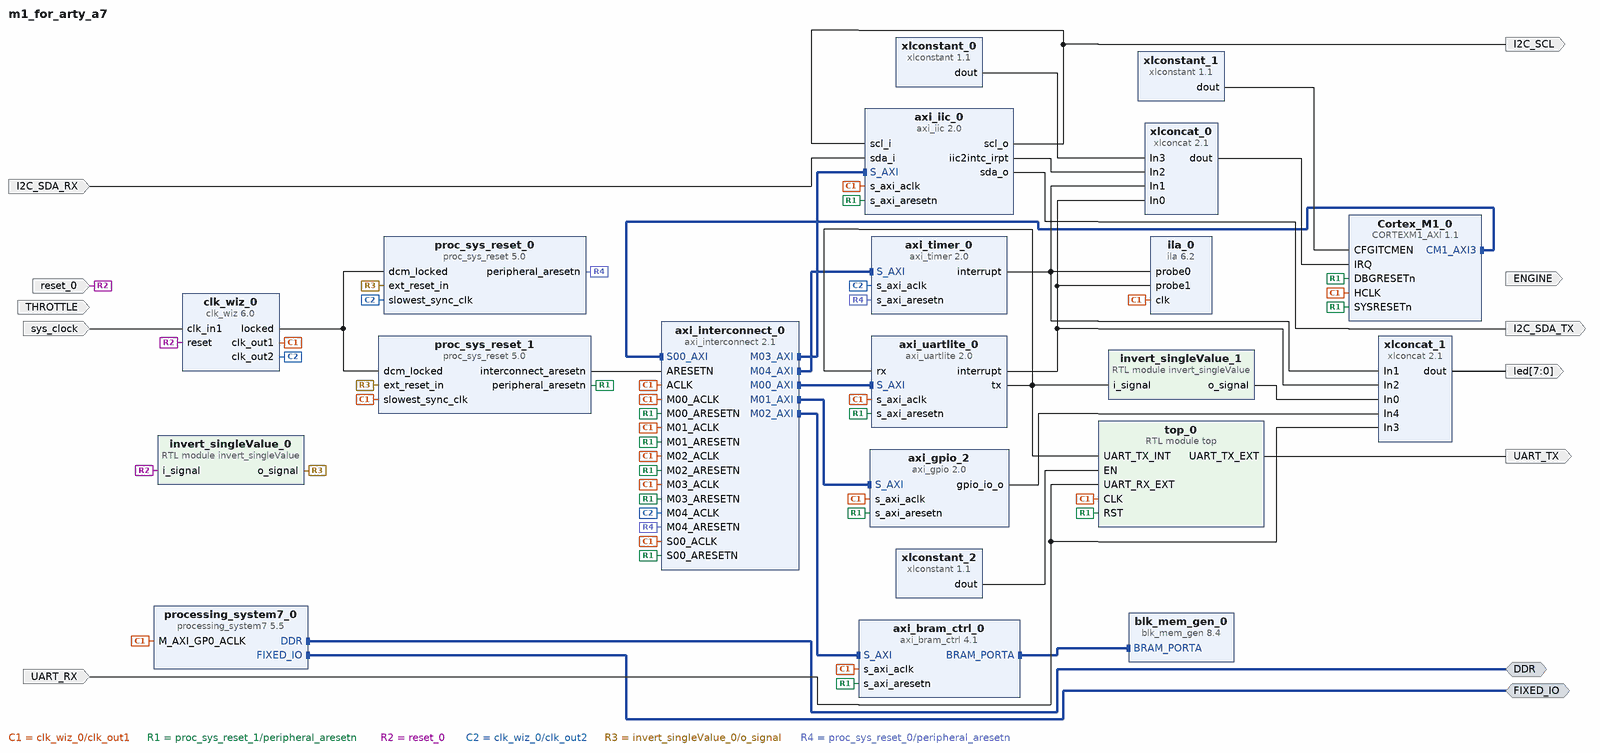
[diagram p0: block diagram of the top level]
# Vivado block design m1_for_arty_a7, xc7z020clg484-1, Vivado 2018.3
create_bd_design m1_for_arty_a7

create_bd_intf_port -mode Master -vlnv xilinx.com:interface:ddrx_rtl:1.0 DDR
create_bd_intf_port -mode Master -vlnv xilinx.com:display_processing_system7:fixedio_rtl:1.0 FIXED_IO
create_bd_port -dir O ENGINE
create_bd_port -dir I THROTTLE
create_bd_port -dir O -from 7 -to 0 led
create_bd_port -dir I -type rst reset_0
set_property -dict {CONFIG.POLARITY ACTIVE_HIGH} [get_bd_ports reset_0]
create_bd_port -dir I UART_RX
create_bd_port -dir I -type clk sys_clock
set_property -dict {CONFIG.FREQ_HZ 100000000 CONFIG.PHASE 0.000} [get_bd_ports sys_clock]
create_bd_port -dir O UART_TX
create_bd_port -dir O I2C_SCL
create_bd_port -dir O I2C_SDA_TX
create_bd_port -dir I I2C_SDA_RX

create_bd_cell -type ip -vlnv arm.com:CortexM:CORTEXM1_AXI:1.1 Cortex_M1_0
set_property -dict [list \
  CONFIG.DEBUG_SEL 1 \
  CONFIG.DTCM_SIZE {"0111"} \
  CONFIG.ITCM_INIT_FILE bram_a7.hex \
  CONFIG.ITCM_INIT_RAM true \
  CONFIG.ITCM_SIZE {"0110"} \
  CONFIG.NUM_IRQ 32 \
  CONFIG.SMALL_DEBUG true \
] [get_bd_cells Cortex_M1_0]
create_bd_cell -type ip -vlnv xilinx.com:ip:xlconcat:2.1 xlconcat_1
set_property -dict [list \
  CONFIG.IN0_WIDTH 1 \
  CONFIG.IN1_WIDTH 1 \
  CONFIG.IN2_WIDTH 1 \
  CONFIG.IN3_WIDTH 1 \
  CONFIG.IN4_WIDTH 4 \
  CONFIG.NUM_PORTS 5 \
] [get_bd_cells xlconcat_1]
create_bd_cell -type ip -vlnv xilinx.com:ip:processing_system7:5.5 processing_system7_0
set_property -dict [list \
  CONFIG.PCW_APU_PERIPHERAL_FREQMHZ 666.666667 \
  CONFIG.PCW_ENET0_ENET0_IO {MIO 16 .. 27} \
  CONFIG.PCW_ENET0_GRP_MDIO_ENABLE 1 \
  CONFIG.PCW_ENET0_GRP_MDIO_IO {MIO 52 .. 53} \
  CONFIG.PCW_ENET0_PERIPHERAL_ENABLE 1 \
  CONFIG.PCW_ENET0_RESET_ENABLE 0 \
  CONFIG.PCW_ENET_RESET_ENABLE 1 \
  CONFIG.PCW_ENET_RESET_SELECT {Share reset pin} \
  CONFIG.PCW_FPGA0_PERIPHERAL_FREQMHZ 100.000000 \
  CONFIG.PCW_FPGA1_PERIPHERAL_FREQMHZ 150.000000 \
  CONFIG.PCW_GPIO_MIO_GPIO_ENABLE 1 \
  CONFIG.PCW_GPIO_MIO_GPIO_IO MIO \
  CONFIG.PCW_I2C_RESET_ENABLE 1 \
  CONFIG.PCW_PRESET_BANK1_VOLTAGE {LVCMOS 1.8V} \
  CONFIG.PCW_QSPI_GRP_SINGLE_SS_ENABLE 1 \
  CONFIG.PCW_QSPI_GRP_SINGLE_SS_IO {MIO 1 .. 6} \
  CONFIG.PCW_QSPI_PERIPHERAL_ENABLE 1 \
  CONFIG.PCW_QSPI_QSPI_IO {MIO 1 .. 6} \
  CONFIG.PCW_SD0_GRP_CD_ENABLE 1 \
  CONFIG.PCW_SD0_GRP_CD_IO {MIO 47} \
  CONFIG.PCW_SD0_GRP_WP_ENABLE 1 \
  CONFIG.PCW_SD0_GRP_WP_IO {MIO 46} \
  CONFIG.PCW_SD0_PERIPHERAL_ENABLE 1 \
  CONFIG.PCW_SD0_SD0_IO {MIO 40 .. 45} \
  CONFIG.PCW_SDIO_PERIPHERAL_FREQMHZ 50 \
  CONFIG.PCW_SINGLE_QSPI_DATA_MODE x4 \
  CONFIG.PCW_TTC0_PERIPHERAL_ENABLE 1 \
  CONFIG.PCW_TTC0_TTC0_IO EMIO \
  CONFIG.PCW_UART1_PERIPHERAL_ENABLE 1 \
  CONFIG.PCW_UART1_UART1_IO {MIO 48 .. 49} \
  CONFIG.PCW_UART_PERIPHERAL_FREQMHZ 50 \
  CONFIG.PCW_UIPARAM_DDR_FREQ_MHZ 533.333313 \
  CONFIG.PCW_UIPARAM_DDR_PARTNO {MT41J128M16 HA-15E} \
  CONFIG.PCW_USB0_PERIPHERAL_ENABLE 1 \
  CONFIG.PCW_USB0_RESET_ENABLE 0 \
  CONFIG.PCW_USB0_USB0_IO {MIO 28 .. 39} \
  CONFIG.PCW_USB_RESET_ENABLE 1 \
  CONFIG.PCW_USB_RESET_SELECT {Share reset pin} \
  CONFIG.preset ZedBoard \
] [get_bd_cells processing_system7_0]
# 223 more settings of processing_system7_0 are not shown: defaults, MIO pin electricals, DDR timing, and values the tool derives
create_bd_cell -type ip -vlnv xilinx.com:ip:xlconcat:2.1 xlconcat_0
set_property -dict [list \
  CONFIG.IN0_WIDTH 1 \
  CONFIG.IN1_WIDTH 1 \
  CONFIG.IN2_WIDTH 1 \
  CONFIG.IN3_WIDTH 29 \
  CONFIG.IN7_WIDTH 24 \
  CONFIG.NUM_PORTS 4 \
] [get_bd_cells xlconcat_0]
create_bd_cell -type module -reference top top_0
create_bd_cell -type ip -vlnv xilinx.com:ip:axi_bram_ctrl:4.1 axi_bram_ctrl_0
set_property -dict {CONFIG.C_SELECT_XPM 0 CONFIG.PROTOCOL AXI4LITE CONFIG.SINGLE_PORT_BRAM 1} [get_bd_cells axi_bram_ctrl_0]
create_bd_cell -type ip -vlnv xilinx.com:ip:axi_gpio:2.0 axi_gpio_2
set_property -dict [list \
  CONFIG.C_ALL_OUTPUTS 1 \
  CONFIG.C_GPIO_WIDTH 4 \
  CONFIG.GPIO_BOARD_INTERFACE Custom \
  CONFIG.USE_BOARD_FLOW true \
] [get_bd_cells axi_gpio_2]
create_bd_cell -type ip -vlnv xilinx.com:ip:axi_iic:2.0 axi_iic_0
create_bd_cell -type ip -vlnv xilinx.com:ip:axi_interconnect:2.1 axi_interconnect_0
set_property -dict [list \
  CONFIG.ENABLE_ADVANCED_OPTIONS 1 \
  CONFIG.ENABLE_PROTOCOL_CHECKERS 0 \
  CONFIG.M00_HAS_DATA_FIFO 0 \
  CONFIG.M00_HAS_REGSLICE 0 \
  CONFIG.M00_SECURE 0 \
  CONFIG.M01_HAS_DATA_FIFO 0 \
  CONFIG.M01_HAS_REGSLICE 0 \
  CONFIG.M01_SECURE 0 \
  CONFIG.M02_HAS_REGSLICE 0 \
  CONFIG.M02_SECURE 0 \
  CONFIG.M03_HAS_REGSLICE 0 \
  CONFIG.M04_HAS_REGSLICE 0 \
  CONFIG.M05_HAS_REGSLICE 0 \
  CONFIG.NUM_MI 5 \
  CONFIG.NUM_SI 1 \
  CONFIG.S00_HAS_DATA_FIFO 0 \
  CONFIG.S00_HAS_REGSLICE 3 \
  CONFIG.S01_HAS_DATA_FIFO 1 \
  CONFIG.S01_HAS_REGSLICE 3 \
  CONFIG.STRATEGY 0 \
  CONFIG.SYNCHRONIZATION_STAGES 3 \
  CONFIG.XBAR_DATA_WIDTH 32 \
] [get_bd_cells axi_interconnect_0]
create_bd_cell -type ip -vlnv xilinx.com:ip:axi_timer:2.0 axi_timer_0
set_property -dict {CONFIG.enable_timer2 0} [get_bd_cells axi_timer_0]
create_bd_cell -type ip -vlnv xilinx.com:ip:axi_uartlite:2.0 axi_uartlite_0
set_property -dict [list \
  CONFIG.C_BAUDRATE 115200 \
  CONFIG.C_S_AXI_ACLK_FREQ_HZ 100000000 \
  CONFIG.UARTLITE_BOARD_INTERFACE Custom \
  CONFIG.USE_BOARD_FLOW true \
] [get_bd_cells axi_uartlite_0]
create_bd_cell -type ip -vlnv xilinx.com:ip:blk_mem_gen:8.4 blk_mem_gen_0
set_property -dict {CONFIG.EN_SAFETY_CKT false} [get_bd_cells blk_mem_gen_0]
create_bd_cell -type ip -vlnv xilinx.com:ip:clk_wiz:6.0 clk_wiz_0
set_property -dict [list \
  CONFIG.CLKOUT1_JITTER 130.958 \
  CONFIG.CLKOUT1_REQUESTED_OUT_FREQ 100 \
  CONFIG.CLKOUT2_JITTER 218.754 \
  CONFIG.CLKOUT2_PHASE_ERROR 98.575 \
  CONFIG.CLKOUT2_REQUESTED_OUT_FREQ 8.000 \
  CONFIG.CLKOUT2_USED true \
  CONFIG.CLK_IN1_BOARD_INTERFACE sys_clock \
  CONFIG.MMCM_CLKOUT0_DIVIDE_F 10.000 \
  CONFIG.MMCM_CLKOUT1_DIVIDE 125 \
  CONFIG.MMCM_DIVCLK_DIVIDE 1 \
  CONFIG.NUM_OUT_CLKS 2 \
  CONFIG.USE_RESET true \
] [get_bd_cells clk_wiz_0]
create_bd_cell -type ip -vlnv xilinx.com:ip:ila:6.2 ila_0
set_property -dict [list \
  CONFIG.ALL_PROBE_SAME_MU_CNT 2 \
  CONFIG.C_ADV_TRIGGER true \
  CONFIG.C_DATA_DEPTH 131072 \
  CONFIG.C_ENABLE_ILA_AXI_MON false \
  CONFIG.C_EN_STRG_QUAL 1 \
  CONFIG.C_MONITOR_TYPE Native \
  CONFIG.C_NUM_OF_PROBES 2 \
  CONFIG.C_PROBE0_MU_CNT 2 \
  CONFIG.C_PROBE10_MU_CNT 2 \
  CONFIG.C_PROBE11_MU_CNT 2 \
  CONFIG.C_PROBE12_MU_CNT 2 \
  CONFIG.C_PROBE13_MU_CNT 2 \
  CONFIG.C_PROBE14_MU_CNT 2 \
  CONFIG.C_PROBE15_MU_CNT 2 \
  CONFIG.C_PROBE16_MU_CNT 2 \
  CONFIG.C_PROBE17_MU_CNT 2 \
  CONFIG.C_PROBE18_MU_CNT 2 \
  CONFIG.C_PROBE19_MU_CNT 2 \
  CONFIG.C_PROBE1_MU_CNT 2 \
  CONFIG.C_PROBE20_MU_CNT 2 \
  CONFIG.C_PROBE21_MU_CNT 2 \
  CONFIG.C_PROBE22_MU_CNT 2 \
  CONFIG.C_PROBE23_MU_CNT 2 \
  CONFIG.C_PROBE24_MU_CNT 2 \
  CONFIG.C_PROBE25_MU_CNT 2 \
  CONFIG.C_PROBE26_MU_CNT 2 \
  CONFIG.C_PROBE27_MU_CNT 2 \
  CONFIG.C_PROBE28_MU_CNT 2 \
  CONFIG.C_PROBE29_MU_CNT 2 \
  CONFIG.C_PROBE2_MU_CNT 2 \
  CONFIG.C_PROBE30_MU_CNT 2 \
  CONFIG.C_PROBE31_MU_CNT 2 \
  CONFIG.C_PROBE32_MU_CNT 2 \
  CONFIG.C_PROBE33_MU_CNT 2 \
  CONFIG.C_PROBE34_MU_CNT 2 \
  CONFIG.C_PROBE35_MU_CNT 2 \
  CONFIG.C_PROBE36_MU_CNT 2 \
  CONFIG.C_PROBE37_MU_CNT 2 \
  CONFIG.C_PROBE38_MU_CNT 2 \
  CONFIG.C_PROBE39_MU_CNT 2 \
  CONFIG.C_PROBE3_MU_CNT 2 \
  CONFIG.C_PROBE40_MU_CNT 2 \
  CONFIG.C_PROBE41_MU_CNT 2 \
  CONFIG.C_PROBE42_MU_CNT 2 \
  CONFIG.C_PROBE43_MU_CNT 2 \
  CONFIG.C_PROBE4_MU_CNT 2 \
  CONFIG.C_PROBE5_MU_CNT 2 \
  CONFIG.C_PROBE6_MU_CNT 2 \
  CONFIG.C_PROBE7_MU_CNT 2 \
  CONFIG.C_PROBE8_MU_CNT 2 \
  CONFIG.C_PROBE9_MU_CNT 2 \
] [get_bd_cells ila_0]
create_bd_cell -type module -reference invert_singleValue invert_singleValue_0
create_bd_cell -type ip -vlnv xilinx.com:ip:proc_sys_reset:5.0 proc_sys_reset_0
create_bd_cell -type ip -vlnv xilinx.com:ip:proc_sys_reset:5.0 proc_sys_reset_1
create_bd_cell -type ip -vlnv xilinx.com:ip:xlconstant:1.1 xlconstant_0
set_property -dict {CONFIG.CONST_VAL 0 CONFIG.CONST_WIDTH 29} [get_bd_cells xlconstant_0]
create_bd_cell -type ip -vlnv xilinx.com:ip:xlconstant:1.1 xlconstant_2
set_property -dict {CONFIG.CONST_VAL 1 CONFIG.CONST_WIDTH 1} [get_bd_cells xlconstant_2]
create_bd_cell -type ip -vlnv xilinx.com:ip:xlconstant:1.1 xlconstant_1
set_property -dict {CONFIG.CONST_WIDTH 2} [get_bd_cells xlconstant_1]
create_bd_cell -type module -reference invert_singleValue invert_singleValue_1

# ---- connections ----

connect_bd_intf_net [get_bd_intf_pins axi_interconnect_0/M03_AXI] [get_bd_intf_pins axi_iic_0/S_AXI]
connect_bd_intf_net [get_bd_intf_pins axi_timer_0/S_AXI] [get_bd_intf_pins axi_interconnect_0/M04_AXI]
connect_bd_intf_net [get_bd_intf_pins Cortex_M1_0/CM1_AXI3] [get_bd_intf_pins axi_interconnect_0/S00_AXI]
connect_bd_intf_net [get_bd_intf_pins axi_bram_ctrl_0/BRAM_PORTA] [get_bd_intf_pins blk_mem_gen_0/BRAM_PORTA]
connect_bd_intf_net [get_bd_intf_pins axi_interconnect_0/M01_AXI] [get_bd_intf_pins axi_gpio_2/S_AXI]
connect_bd_intf_net [get_bd_intf_pins axi_interconnect_0/M02_AXI] [get_bd_intf_pins axi_bram_ctrl_0/S_AXI]
connect_bd_intf_net [get_bd_intf_ports DDR] [get_bd_intf_pins processing_system7_0/DDR]
connect_bd_intf_net [get_bd_intf_ports FIXED_IO] [get_bd_intf_pins processing_system7_0/FIXED_IO]
connect_bd_intf_net [get_bd_intf_pins axi_uartlite_0/S_AXI] [get_bd_intf_pins axi_interconnect_0/M00_AXI]
connect_bd_net [get_bd_pins clk_wiz_0/clk_out1] \
  [get_bd_pins Cortex_M1_0/HCLK] [get_bd_pins processing_system7_0/M_AXI_GP0_ACLK] [get_bd_pins top_0/CLK] \
  [get_bd_pins axi_bram_ctrl_0/s_axi_aclk] [get_bd_pins axi_gpio_2/s_axi_aclk] [get_bd_pins axi_iic_0/s_axi_aclk] \
  [get_bd_pins axi_interconnect_0/ACLK] [get_bd_pins axi_interconnect_0/S00_ACLK] [get_bd_pins axi_interconnect_0/M00_ACLK] \
  [get_bd_pins axi_interconnect_0/M01_ACLK] [get_bd_pins axi_interconnect_0/M02_ACLK] \
  [get_bd_pins axi_interconnect_0/M03_ACLK] [get_bd_pins axi_uartlite_0/s_axi_aclk] [get_bd_pins ila_0/clk] \
  [get_bd_pins proc_sys_reset_1/slowest_sync_clk]
connect_bd_net -net reset_0_1 [get_bd_pins proc_sys_reset_1/peripheral_aresetn] \
  [get_bd_pins Cortex_M1_0/SYSRESETn] [get_bd_pins Cortex_M1_0/DBGRESETn] [get_bd_pins top_0/RST] \
  [get_bd_pins axi_bram_ctrl_0/s_axi_aresetn] [get_bd_pins axi_gpio_2/s_axi_aresetn] [get_bd_pins axi_iic_0/s_axi_aresetn] \
  [get_bd_pins axi_interconnect_0/S00_ARESETN] [get_bd_pins axi_interconnect_0/M00_ARESETN] \
  [get_bd_pins axi_interconnect_0/M01_ARESETN] [get_bd_pins axi_interconnect_0/M02_ARESETN] \
  [get_bd_pins axi_interconnect_0/M03_ARESETN] [get_bd_pins axi_uartlite_0/s_axi_aresetn]
connect_bd_net [get_bd_pins xlconstant_1/dout] [get_bd_pins Cortex_M1_0/CFGITCMEN]
connect_bd_net [get_bd_pins xlconcat_1/dout] [get_bd_ports led]
connect_bd_net -net reset_0_2 [get_bd_ports reset_0] [get_bd_pins clk_wiz_0/reset] [get_bd_pins invert_singleValue_0/i_signal]
connect_bd_net [get_bd_pins xlconcat_0/dout] [get_bd_pins Cortex_M1_0/IRQ]
connect_bd_net -net axi_uartlite_0_interrupt [get_bd_pins axi_uartlite_0/interrupt] \
  [get_bd_pins xlconcat_0/In0] [get_bd_pins xlconcat_1/In2] [get_bd_pins ila_0/probe1]
connect_bd_net [get_bd_pins xlconstant_2/dout] [get_bd_pins top_0/EN]
connect_bd_net [get_bd_pins axi_gpio_2/gpio_io_o] [get_bd_pins xlconcat_1/In4]
connect_bd_net [get_bd_pins axi_uartlite_0/tx] \
  [get_bd_pins top_0/UART_TX_INT] [get_bd_pins axi_uartlite_0/rx] [get_bd_pins invert_singleValue_1/i_signal]
connect_bd_net [get_bd_pins invert_singleValue_1/o_signal] [get_bd_pins xlconcat_1/In0]
connect_bd_net -net axi_timer_0_interrupt [get_bd_pins axi_timer_0/interrupt] \
  [get_bd_pins xlconcat_0/In1] [get_bd_pins xlconcat_1/In1] [get_bd_pins ila_0/probe0]
connect_bd_net [get_bd_ports UART_RX] [get_bd_pins top_0/UART_RX_EXT] [get_bd_pins xlconcat_1/In3]
connect_bd_net [get_bd_pins xlconstant_0/dout] [get_bd_pins xlconcat_0/In3]
connect_bd_net [get_bd_pins axi_iic_0/iic2intc_irpt] [get_bd_pins xlconcat_0/In2]
connect_bd_net -net M04_ACLK_1 [get_bd_pins clk_wiz_0/clk_out2] \
  [get_bd_pins axi_interconnect_0/M04_ACLK] [get_bd_pins axi_timer_0/s_axi_aclk] \
  [get_bd_pins proc_sys_reset_0/slowest_sync_clk]
connect_bd_net [get_bd_ports sys_clock] [get_bd_pins clk_wiz_0/clk_in1]
connect_bd_net [get_bd_pins invert_singleValue_0/o_signal] [get_bd_pins proc_sys_reset_0/ext_reset_in] [get_bd_pins proc_sys_reset_1/ext_reset_in]
connect_bd_net [get_bd_pins clk_wiz_0/locked] [get_bd_pins proc_sys_reset_0/dcm_locked] [get_bd_pins proc_sys_reset_1/dcm_locked]
connect_bd_net [get_bd_pins proc_sys_reset_1/interconnect_aresetn] [get_bd_pins axi_interconnect_0/ARESETN]
connect_bd_net -net M04_ARESETN_1 [get_bd_pins proc_sys_reset_0/peripheral_aresetn] \
  [get_bd_pins axi_interconnect_0/M04_ARESETN] [get_bd_pins axi_timer_0/s_axi_aresetn]
connect_bd_net [get_bd_pins top_0/UART_TX_EXT] [get_bd_ports UART_TX]
connect_bd_net [get_bd_pins axi_iic_0/scl_o] [get_bd_ports I2C_SCL] [get_bd_pins axi_iic_0/scl_i]
connect_bd_net [get_bd_pins axi_iic_0/sda_o] [get_bd_ports I2C_SDA_TX]
connect_bd_net [get_bd_ports I2C_SDA_RX] [get_bd_pins axi_iic_0/sda_i]
set_property HDL_ATTRIBUTE.DEBUG true [get_bd_nets axi_uartlite_0_interrupt]
set_property HDL_ATTRIBUTE.MARK_DEBUG true [get_bd_nets axi_uartlite_0_interrupt]
set_property HDL_ATTRIBUTE.DEBUG true [get_bd_nets axi_timer_0_interrupt]
set_property HDL_ATTRIBUTE.MARK_DEBUG true [get_bd_nets axi_timer_0_interrupt]

# ---- address map ----
assign_bd_address -offset 0x40000000 -range 64K -target_address_space [get_bd_addr_spaces Cortex_M1_0/CM1_AXI3] [get_bd_addr_segs axi_gpio_2/S_AXI/Reg]
assign_bd_address -offset 0x40100000 -range 64K -target_address_space [get_bd_addr_spaces Cortex_M1_0/CM1_AXI3] [get_bd_addr_segs axi_uartlite_0/S_AXI/Reg]
assign_bd_address -offset 0x40800000 -range 64K -target_address_space [get_bd_addr_spaces Cortex_M1_0/CM1_AXI3] [get_bd_addr_segs axi_iic_0/S_AXI/Reg]
assign_bd_address -offset 0x41C00000 -range 64K -target_address_space [get_bd_addr_spaces Cortex_M1_0/CM1_AXI3] [get_bd_addr_segs axi_timer_0/S_AXI/Reg]
assign_bd_address -offset 0xC0000000 -range 64K -target_address_space [get_bd_addr_spaces Cortex_M1_0/CM1_AXI3] [get_bd_addr_segs axi_bram_ctrl_0/S_AXI/Mem0]

validate_bd_design
save_bd_design
